# Altium project STM32_IO_SMD.PrjPcb
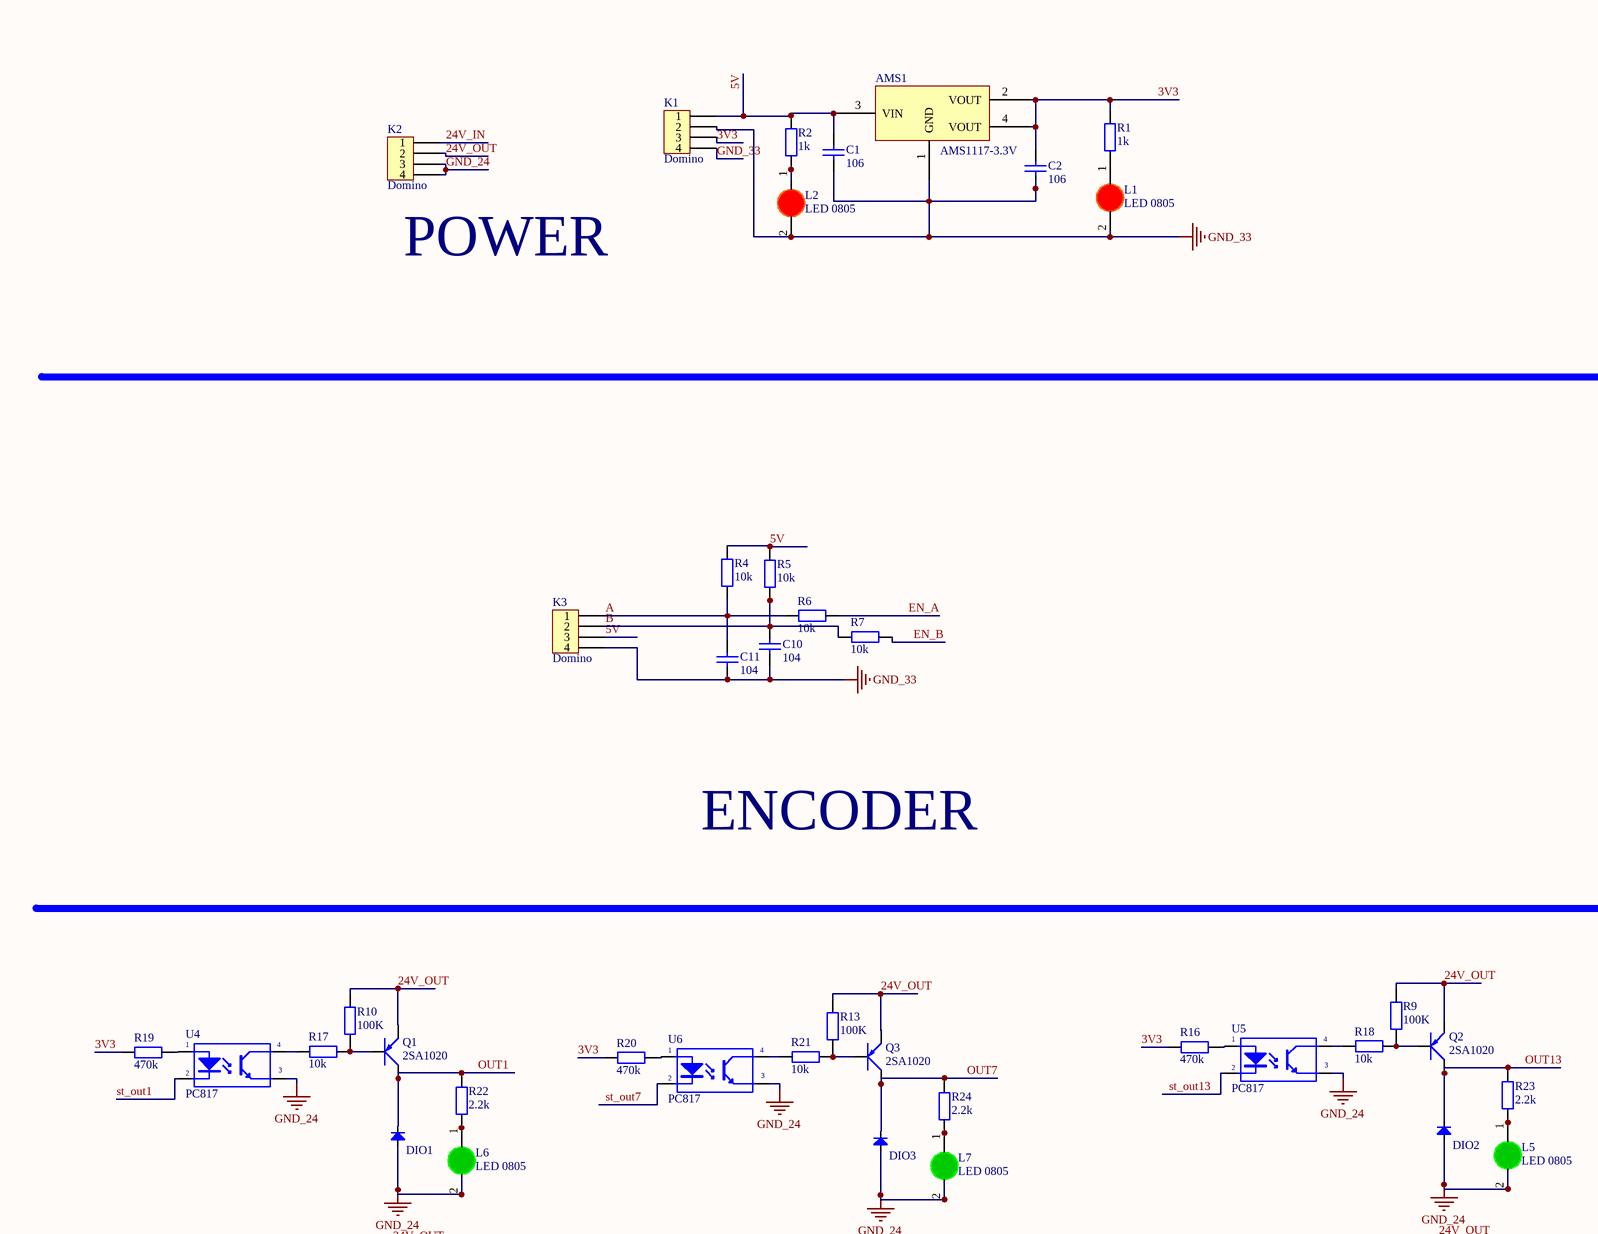
[diagram p0: schematic.SchDoc, top left]
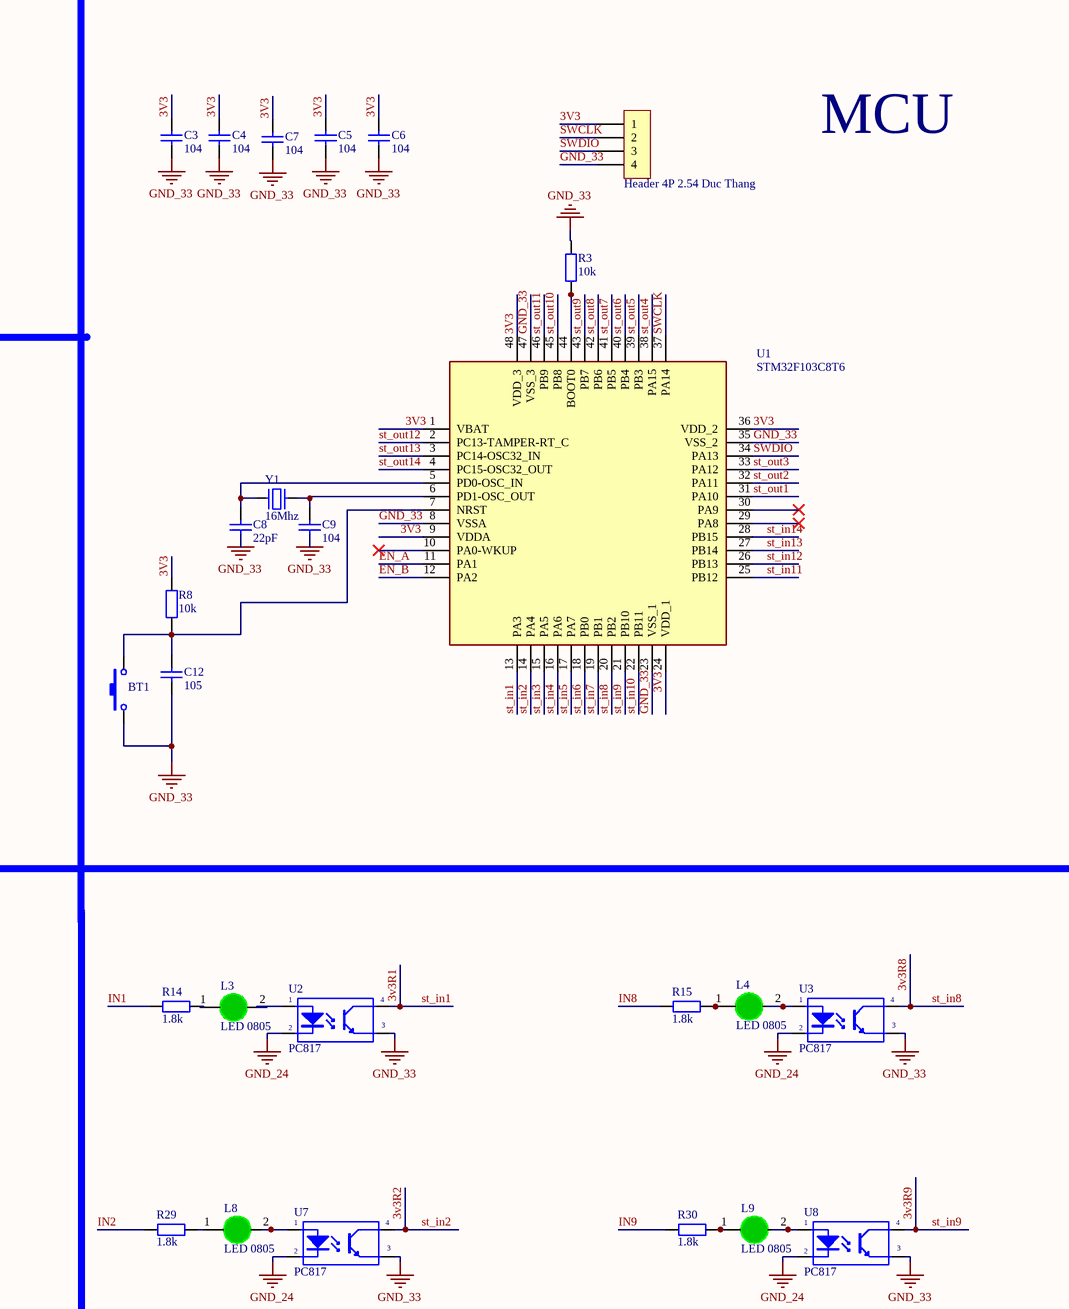
[diagram p1: schematic.SchDoc, top right]
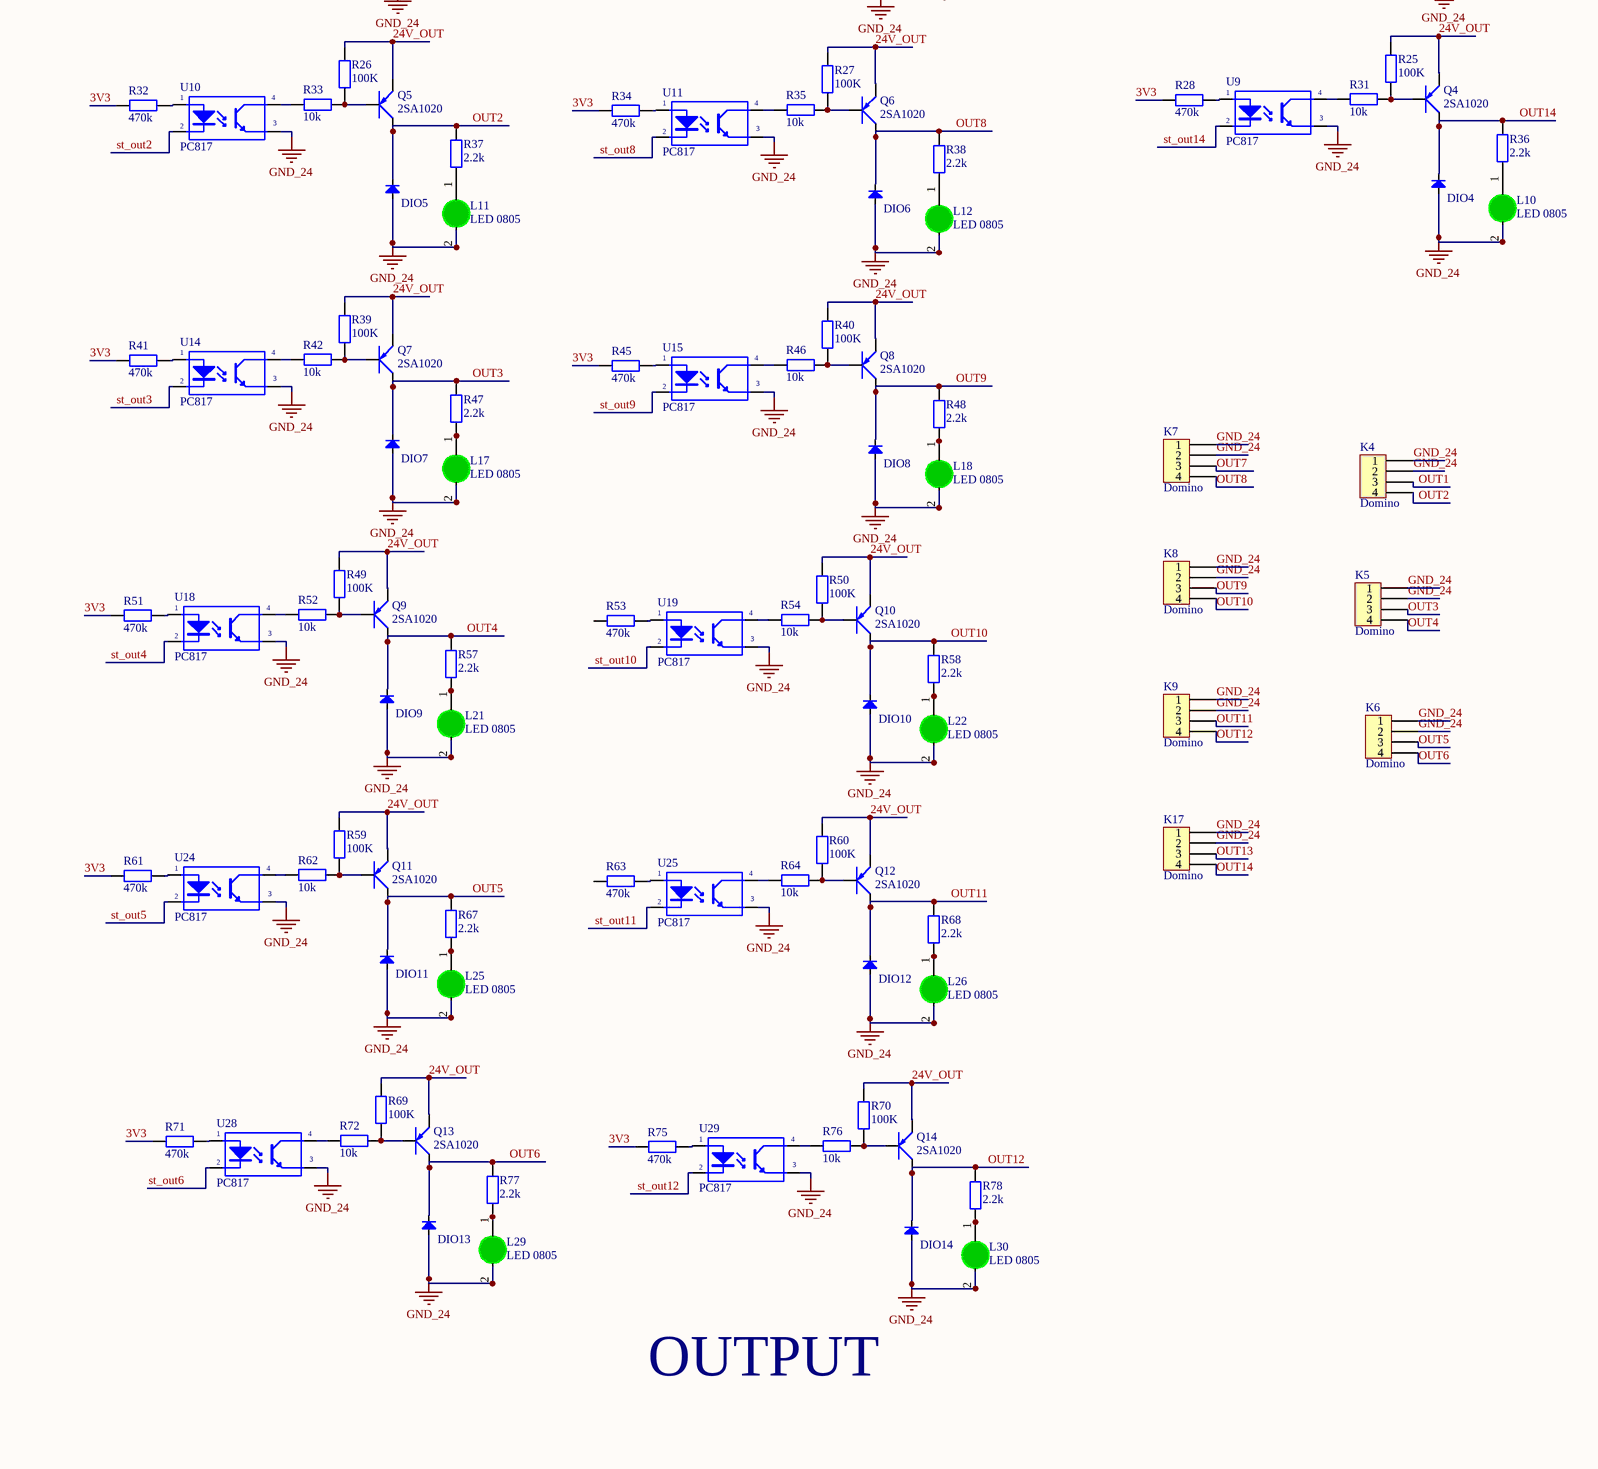
[diagram p2: schematic.SchDoc, bottom left]
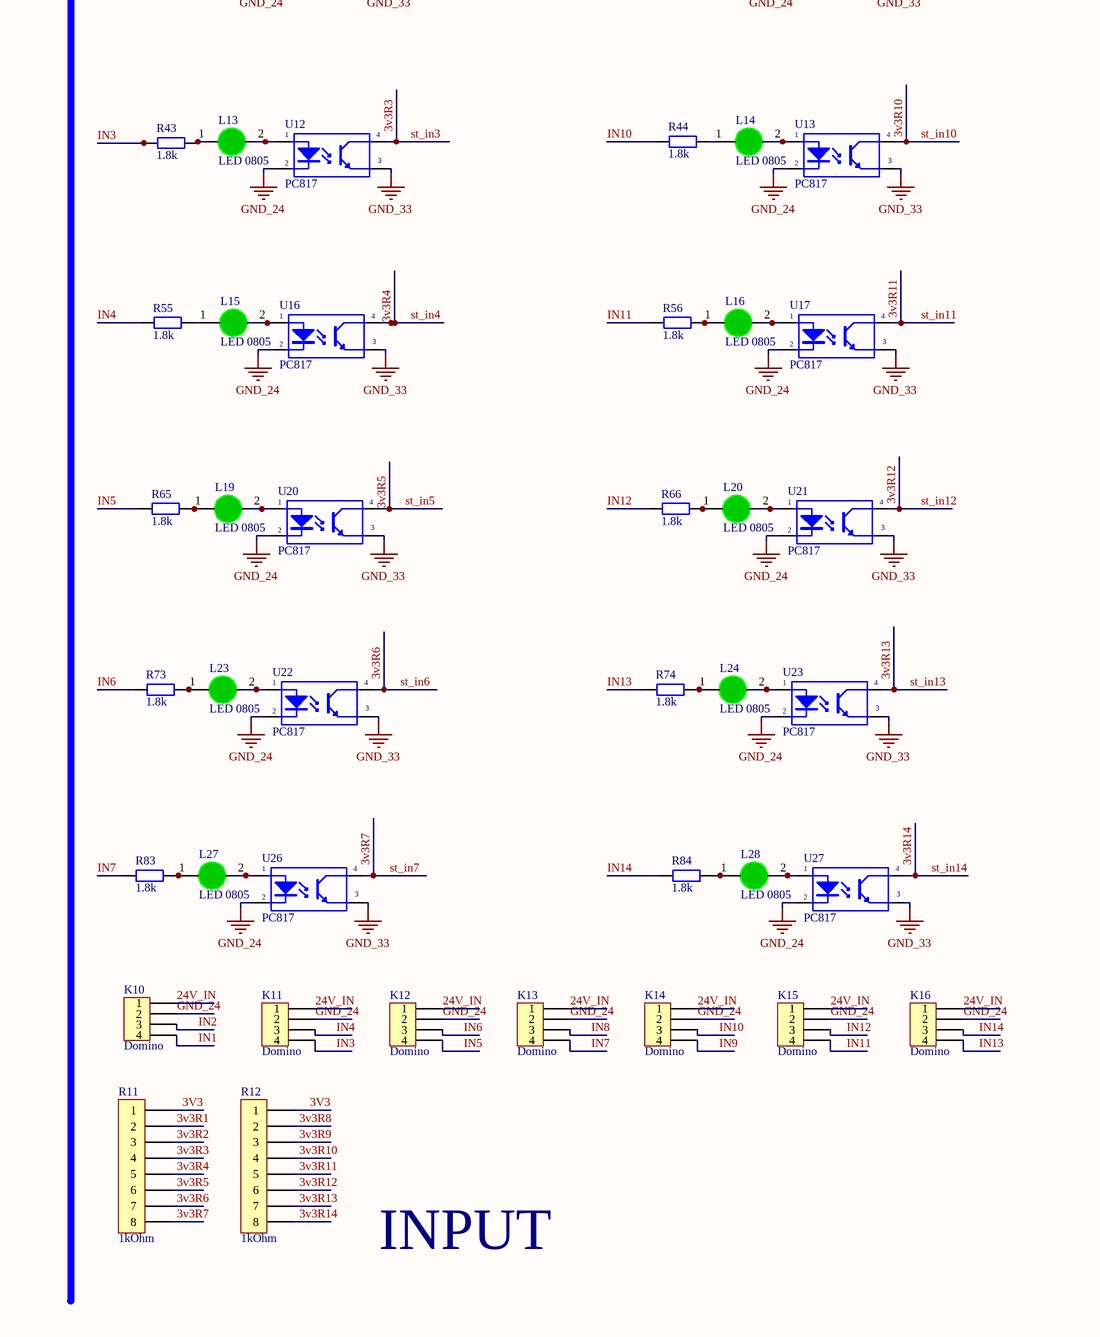
[diagram p3: schematic.SchDoc, bottom right]
1 sheet, 200 parts. Net scope: global (net labels, ports and power ports of the same name join across sheets).
Board file: PCB.PcbDoc

## Sheet schematic.SchDoc
size 500 x 500 mm; SheetNumber: 1; SheetTotal: 1

### Parts
AMS1  AMS1117-3.3V  [SOT223]
BT1  Nut Nhan 2 Chan SMD 3x6x2.5  [Nut Nhan 2 Chan SMD 3x6x2.5]  (value not drawn)
C1  106  [tu 1206]
C2  106  [tu 1206]
C3  104  [tu 1206]
C4  104  [tu 1206]
C5  104  [tu 1206]
C6  104  [tu 1206]
C7  104  [tu 1206]
C8  22pF  [tu 1206]
C9  104  [tu 1206]
C10  104  [tu 1206]
C11  104  [tu 1206]
C12  105  [tu 1206]
DIO1  Diode SMD  [DIO-SMD-123]  (value not drawn)
DIO2  Diode SMD  [DIO-SMD-123]  (value not drawn)
DIO3  Diode SMD  [DIO-SMD-123]  (value not drawn)
DIO4  Diode SMD  [DIO-SMD-123]  (value not drawn)
DIO5  Diode SMD  [DIO-SMD-123]  (value not drawn)
DIO6  Diode SMD  [DIO-SMD-123]  (value not drawn)
DIO7  Diode SMD  [DIO-SMD-123]  (value not drawn)
DIO8  Diode SMD  [DIO-SMD-123]  (value not drawn)
DIO9  Diode SMD  [DIO-SMD-123]  (value not drawn)
DIO10  Diode SMD  [DIO-SMD-123]  (value not drawn)
DIO11  Diode SMD  [DIO-SMD-123]  (value not drawn)
DIO12  Diode SMD  [DIO-SMD-123]  (value not drawn)
DIO13  Diode SMD  [DIO-SMD-123]  (value not drawn)
DIO14  Diode SMD  [DIO-SMD-123]  (value not drawn)
H1  Header 4P 2.54 Duc Thang  [XH2.54M-4]
K1  Domino  [KF128HL_2P]
K2  Domino  [KF128HL_2P]
K3  Domino  [KF128HL_2P]
K4  Domino  [KF128HL_2P]
K5  Domino  [KF128HL_2P]
K6  Domino  [KF128HL_2P]
K7  Domino  [KF128HL_2P]
K8  Domino  [KF128HL_2P]
K9  Domino  [KF128HL_2P]
K10  Domino  [KF128HL_2P]
K11  Domino  [KF128HL_2P]
K12  Domino  [KF128HL_2P]
K13  Domino  [KF128HL_2P]
K14  Domino  [KF128HL_2P]
K15  Domino  [KF128HL_2P]
K16  Domino  [KF128HL_2P]
K17  Domino  [KF128HL_2P]
L1  LED 0805  [LED-1206-Red]
L2  LED 0805  [LED-1206-Red]
L3  LED 0805  [LED-1206-Green]
L4  LED 0805  [LED-1206-Green]
L5  LED 0805  [LED-1206-Green]
L6  LED 0805  [LED-1206-Green]
L7  LED 0805  [LED-1206-Green]
L8  LED 0805  [LED-1206-Green]
L9  LED 0805  [LED-1206-Green]
L10  LED 0805  [LED-1206-Green]
L11  LED 0805  [LED-1206-Green]
L12  LED 0805  [LED-1206-Green]
L13  LED 0805  [LED-1206-Green]
L14  LED 0805  [LED-1206-Green]
L15  LED 0805  [LED-1206-Green]
L16  LED 0805  [LED-1206-Green]
L17  LED 0805  [LED-1206-Green]
L18  LED 0805  [LED-1206-Green]
L19  LED 0805  [LED-1206-Green]
L20  LED 0805  [LED-1206-Green]
L21  LED 0805  [LED-1206-Green]
L22  LED 0805  [LED-1206-Green]
L23  LED 0805  [LED-1206-Green]
L24  LED 0805  [LED-1206-Green]
L25  LED 0805  [LED-1206-Green]
L26  LED 0805  [LED-1206-Green]
L27  LED 0805  [LED-1206-Green]
L28  LED 0805  [LED-1206-Green]
L29  LED 0805  [LED-1206-Green]
L30  LED 0805  [LED-1206-Green]
Q1  2SA1020  [TO92-123]
Q2  2SA1020  [TO92-123]
Q3  2SA1020  [TO92-123]
Q4  2SA1020  [TO92-123]
Q5  2SA1020  [TO92-123]
Q6  2SA1020  [TO92-123]
Q7  2SA1020  [TO92-123]
Q8  2SA1020  [TO92-123]
Q9  2SA1020  [TO92-123]
Q10  2SA1020  [TO92-123]
Q11  2SA1020  [TO92-123]
Q12  2SA1020  [TO92-123]
Q13  2SA1020  [TO92-123]
Q14  2SA1020  [TO92-123]
R1  1k  [tro smd 1206]
R2  1k  [tro smd 1206]
R3  10k  [tro smd 1206]
R4  10k  [tro smd 1206]
R5  10k  [tro smd 1206]
R6  10k  [tro smd 1206]
R7  10k  [tro smd 1206]
R8  10k  [tro smd 1206]
R9  100K  [tro smd 1206]
R10  100K  [tro smd 1206]
R11  1kOhm  [resistor_bar]
R12  1kOhm  [resistor_bar]
R13  100K  [tro smd 1206]
R14  1.8k  [tro smd 1206]
R15  1.8k  [tro smd 1206]
R16  470k  [tro smd 1206]
R17  10k  [tro smd 1206]
R18  10k  [tro smd 1206]
R19  470k  [tro smd 1206]
R20  470k  [tro smd 1206]
R21  10k  [tro smd 1206]
R22  2.2k  [tro smd 1206]
R23  2.2k  [tro smd 1206]
R24  2.2k  [tro smd 1206]
R25  100K  [tro smd 1206]
R26  100K  [tro smd 1206]
R27  100K  [tro smd 1206]
R28  470k  [tro smd 1206]
R29  1.8k  [tro smd 1206]
R30  1.8k  [tro smd 1206]
R31  10k  [tro smd 1206]
R32  470k  [tro smd 1206]
R33  10k  [tro smd 1206]
R34  470k  [tro smd 1206]
R35  10k  [tro smd 1206]
R36  2.2k  [tro smd 1206]
R37  2.2k  [tro smd 1206]
R38  2.2k  [tro smd 1206]
R39  100K  [tro smd 1206]
R40  100K  [tro smd 1206]
R41  470k  [tro smd 1206]
R42  10k  [tro smd 1206]
R43  1.8k  [tro smd 1206]
R44  1.8k  [tro smd 1206]
R45  470k  [tro smd 1206]
R46  10k  [tro smd 1206]
R47  2.2k  [tro smd 1206]
R48  2.2k  [tro smd 1206]
R49  100K  [tro smd 1206]
R50  100K  [tro smd 1206]
R51  470k  [tro smd 1206]
R52  10k  [tro smd 1206]
R53  470k  [tro smd 1206]
R54  10k  [tro smd 1206]
R55  1.8k  [tro smd 1206]
R56  1.8k  [tro smd 1206]
R57  2.2k  [tro smd 1206]
R58  2.2k  [tro smd 1206]
R59  100K  [tro smd 1206]
R60  100K  [tro smd 1206]
R61  470k  [tro smd 1206]
R62  10k  [tro smd 1206]
R63  470k  [tro smd 1206]
R64  10k  [tro smd 1206]
R65  1.8k  [tro smd 1206]
R66  1.8k  [tro smd 1206]
R67  2.2k  [tro smd 1206]
R68  2.2k  [tro smd 1206]
R69  100K  [tro smd 1206]
R70  100K  [tro smd 1206]
R71  470k  [tro smd 1206]
R72  10k  [tro smd 1206]
R73  1.8k  [tro smd 1206]
R74  1.8k  [tro smd 1206]
R75  470k  [tro smd 1206]
R76  10k  [tro smd 1206]
R77  2.2k  [tro smd 1206]
R78  2.2k  [tro smd 1206]
R83  1.8k  [tro smd 1206]
R84  1.8k  [tro smd 1206]
U1  STM32F103C8T6  [LQFP-48_19.6_393_58X11_SMD]
U2  PC817  [DIP4]
U3  PC817  [DIP4]
U4  PC817  [DIP4]
U5  PC817  [DIP4]
U6  PC817  [DIP4]
U7  PC817  [DIP4]
U8  PC817  [DIP4]
U9  PC817  [DIP4]
U10  PC817  [DIP4]
U11  PC817  [DIP4]
U12  PC817  [DIP4]
U13  PC817  [DIP4]
U14  PC817  [DIP4]
U15  PC817  [DIP4]
U16  PC817  [DIP4]
U17  PC817  [DIP4]
U18  PC817  [DIP4]
U19  PC817  [DIP4]
U20  PC817  [DIP4]
U21  PC817  [DIP4]
U22  PC817  [DIP4]
U23  PC817  [DIP4]
U24  PC817  [DIP4]
U25  PC817  [DIP4]
U26  PC817  [DIP4]
U27  PC817  [DIP4]
U28  PC817  [DIP4]
U29  PC817  [DIP4]
Y1  16Mhz  [Thach Anh 2 chan cam]

### Nets
GND_24: DIO1.1(A) DIO2.1(A) DIO3.1(A) DIO4.1(A) DIO5.1(A) DIO6.1(A) DIO7.1(A) DIO8.1(A) DIO9.1(A) DIO10.1(A) DIO11.1(A) DIO12.1(A) DIO13.1(A) DIO14.1(A) K2.3 K2.4 K4.1 K4.2 K5.1 K5.2 K6.1 K6.2 K7.1 K7.2 K8.1 K8.2 K9.1 K9.2 K10.2 K11.2 K12.2 K13.2 K14.2 K15.2 K16.2 K17.1 K17.2 L5.2(K) L6.2(K) L7.2(K) L10.2(K) L11.2(K) L12.2(K) L17.2(K) L18.2(K) L21.2(K) L22.2(K) L25.2(K) L26.2(K) L29.2(K) L30.2(K) U2.2(K) U3.2(K) U4.3(E) U5.3(E) U6.3(E) U7.2(K) U8.2(K) U9.3(E) U10.3(E) U11.3(E) U12.2(K) U13.2(K) U14.3(E) U15.3(E) U16.2(K) U17.2(K) U18.3(E) U19.3(E) U20.2(K) U21.2(K) U22.2(K) U23.2(K) U24.3(E) U25.3(E) U26.2(K) U27.2(K) U28.3(E) U29.3(E)
GND_33: AMS1.1(GND) BT1.1 C1.2 C2.2 C3.2 C4.2 C5.2 C6.2 C7.2 C8.2 C9.2 C10.2 C11.2 C12.2 H1.4 K1.2 K1.4 K3.4 L1.2(K) L2.2(K) R3.2 U1.8(VSSA) U1.23(VSS_1) U1.35(VSS_2) U1.47(VSS_3) U2.3(E) U3.3(E) U7.3(E) U8.3(E) U12.3(E) U13.3(E) U16.3(E) U17.3(E) U20.3(E) U21.3(E) U22.3(E) U23.3(E) U26.3(E) U27.3(E)
3V3: AMS1.2(VOUT) AMS1.4(VOUT) C2.1 C3.1 C4.1 C5.1 C6.1 C7.1 H1.1 K1.3 R1.2 R8.2 R11.1 R12.1 R16.1 R19.1 R20.1 R28.1 R32.1 R34.1 R41.1 R45.1 R51.1 R61.1 R71.1 R75.1 U1.1(VBAT) U1.9(VDDA) U1.24(VDD_1) U1.36(VDD_2) U1.48(VDD_3)
3v3R1: R11.2 U1.13(PA3) U2.4(C)  [also labelled st_in1]
3v3R2: R11.3 U1.14(PA4) U7.4(C)  [also labelled st_in2]
3v3R3: R11.4 U1.15(PA5) U12.4(C)  [also labelled st_in3]
3v3R4: R11.5 U1.16(PA6) U16.4(C)  [also labelled st_in4]
3v3R5: R11.6 U1.17(PA7) U20.4(C)  [also labelled st_in5]
3v3R6: R11.7 U1.18(PB0) U22.4(C)  [also labelled st_in6]
3v3R7: R11.8 U1.19(PB1) U26.4(C)  [also labelled st_in7]
3v3R8: R12.2 U1.20(PB2) U3.4(C)  [also labelled st_in8]
3v3R9: R12.3 U1.21(PB10) U8.4(C)  [also labelled st_in9]
3v3R10: R12.4 U1.22(PB11) U13.4(C)  [also labelled st_in10]
3v3R11: R12.5 U1.25(PB12) U17.4(C)  [also labelled st_in11]
3v3R12: R12.6 U1.26(PB13) U21.4(C)  [also labelled st_in12]
3v3R13: R12.7 U1.27(PB14) U23.4(C)  [also labelled st_in13]
3v3R14: R12.8 U1.28(PB15) U27.4(C)  [also labelled st_in14]
5V: AMS1.3(VIN) C1.1 K1.1 K3.3 R2.2 R4.2 R5.2
24V_IN: K2.1 K10.1 K11.1 K12.1 K13.1 K14.1 K15.1 K16.1
24V_OUT: K2.2 Q1.1(E) Q2.1(E) Q3.1(E) Q4.1(E) Q5.1(E) Q6.1(E) Q7.1(E) Q8.1(E) Q9.1(E) Q10.1(E) Q11.1(E) Q12.1(E) Q13.1(E) Q14.1(E) R9.2 R10.2 R13.2 R25.2 R26.2 R27.2 R39.2 R40.2 R49.2 R50.2 R59.2 R60.2 R69.2 R70.2
A: C11.1 K3.1 R4.1 R6.2
B: C10.1 K3.2 R5.1 R7.2
EN_A: R6.1 U1.11(PA1)
EN_B: R7.1 U1.12(PA2)
IN1: K10.4 R14.1
IN2: K10.3 R29.1
IN3: K11.4 R43.1
IN4: K11.3 R55.1
IN5: K12.4 R65.1
IN6: K12.3 R73.1
IN7: K13.4 R83.1
IN8: K13.3 R15.1
IN9: K14.4 R30.1
IN10: K14.3 R44.1
IN11: K15.4 R56.1
IN12: K15.3 R66.1
IN13: K16.4 R74.1
IN14: K16.3 R84.1
OUT1: DIO1.2(K) K4.3 Q1.2(C) R22.2
OUT2: DIO5.2(K) K4.4 Q5.2(C) R37.2
OUT3: DIO7.2(K) K5.3 Q7.2(C) R47.2
OUT4: DIO9.2(K) K5.4 Q9.2(C) R57.2
OUT5: DIO11.2(K) K6.3 Q11.2(C) R67.2
OUT6: DIO13.2(K) K6.4 Q13.2(C) R77.2
OUT7: DIO3.2(K) K7.3 Q3.2(C) R24.2
OUT8: DIO6.2(K) K7.4 Q6.2(C) R38.2
OUT9: DIO8.2(K) K8.3 Q8.2(C) R48.2
OUT10: DIO10.2(K) K8.4 Q10.2(C) R58.2
OUT11: DIO12.2(K) K9.3 Q12.2(C) R68.2
OUT12: DIO14.2(K) K9.4 Q14.2(C) R78.2
OUT13: DIO2.2(K) K17.3 Q2.2(C) R23.2
OUT14: DIO4.2(K) K17.4 Q4.2(C) R36.2
st_out1: U1.31(PA10) U4.2(K)
st_out2: U1.32(PA11) U10.2(K)
st_out3: U1.33(PA12) U14.2(K)
st_out4: U1.38(PA15) U18.2(K)
st_out5: U1.39(PB3) U24.2(K)
st_out6: U1.40(PB4) U28.2(K)
st_out7: U1.41(PB5) U6.2(K)
st_out8: U1.42(PB6) U11.2(K)
st_out9: U1.43(PB7) U15.2(K)
st_out10: U1.45(PB8) U19.2(K)
st_out11: U1.46(PB9) U25.2(K)
st_out12: U1.2(PC13-TAMPER-RT_C) U29.2(K)
st_out13: U1.3(PC14-OSC32_IN) U5.2(K)
st_out14: U1.4(PC15-OSC32_OUT) U9.2(K)
SWCLK: H1.2 U1.37(PA14)
SWDIO: H1.3 U1.34(PA13)
NetBT1_2: BT1.2 C12.1 R8.1 U1.7(NRST)
NetC8_1: C8.1 U1.5(PD0-OSC_IN) Y1.1
NetC9_1: C9.1 U1.6(PD1-OSC_OUT) Y1.2
NetL1_1: L1.1(A) R1.1
NetL2_1: L2.1(A) R2.1
NetL3_1: L3.1(A) R14.2
NetL3_2: L3.2(K) U2.1(A)
NetL4_1: L4.1(A) R15.2
NetL4_2: L4.2(K) U3.1(A)
NetL5_1: L5.1(A) R23.1
NetL6_1: L6.1(A) R22.1
NetL7_1: L7.1(A) R24.1
NetL8_1: L8.1(A) R29.2
NetL8_2: L8.2(K) U7.1(A)
NetL9_1: L9.1(A) R30.2
NetL9_2: L9.2(K) U8.1(A)
NetL13_1: L13.1(A) R43.2
NetL13_2: L13.2(K) U12.1(A)
NetL14_1: L14.1(A) R44.2
NetL14_2: L14.2(K) U13.1(A)
NetL15_1: L15.1(A) R55.2
NetL15_2: L15.2(K) U16.1(A)
NetL16_1: L16.1(A) R56.2
NetL16_2: L16.2(K) U17.1(A)
NetL17_1: L17.1(A) R47.1
NetL18_1: L18.1(A) R48.1
NetL19_1: L19.1(A) R65.2
NetL19_2: L19.2(K) U20.1(A)
NetL20_1: L20.1(A) R66.2
NetL20_2: L20.2(K) U21.1(A)
NetL21_1: L21.1(A) R57.1
NetL22_1: L22.1(A) R58.1
NetL23_1: L23.1(A) R73.2
NetL23_2: L23.2(K) U22.1(A)
NetL24_1: L24.1(A) R74.2
NetL24_2: L24.2(K) U23.1(A)
NetL25_1: L25.1(A) R67.1
NetL26_1: L26.1(A) R68.1
NetL27_1: L27.1(A) R83.2
NetL27_2: L27.2(K) U26.1(A)
NetL28_1: L28.1(A) R84.2
NetL28_2: L28.2(K) U27.1(A)
NetL29_1: L29.1(A) R77.1
NetL30_1: L30.1(A) R78.1
NetQ1_3: Q1.3(B) R10.1 R17.1
NetQ2_3: Q2.3(B) R9.1 R18.1
NetQ3_3: Q3.3(B) R13.1 R21.1
NetQ4_3: Q4.3(B) R25.1 R31.1
NetQ5_3: Q5.3(B) R26.1 R33.1
NetQ6_3: Q6.3(B) R27.1 R35.1
NetQ7_3: Q7.3(B) R39.1 R42.1
NetQ8_3: Q8.3(B) R40.1 R46.1
NetQ9_3: Q9.3(B) R49.1 R52.1
NetQ10_3: Q10.3(B) R50.1 R54.1
NetQ11_3: Q11.3(B) R59.1 R62.1
NetQ12_3: Q12.3(B) R60.1 R64.1
NetQ13_3: Q13.3(B) R69.1 R72.1
NetQ14_3: Q14.3(B) R70.1 R76.1
NetR3_1: R3.1 U1.44(BOOT0)
NetR16_2: R16.2 U5.1(A)
NetR17_2: R17.2 U4.4(C)
NetR18_2: R18.2 U5.4(C)
NetR19_2: R19.2 U4.1(A)
NetR20_2: R20.2 U6.1(A)
NetR21_2: R21.2 U6.4(C)
NetR28_2: R28.2 U9.1(A)
NetR31_2: R31.2 U9.4(C)
NetR32_2: R32.2 U10.1(A)
NetR33_2: R33.2 U10.4(C)
NetR34_2: R34.2 U11.1(A)
NetR35_2: R35.2 U11.4(C)
NetR41_2: R41.2 U14.1(A)
NetR42_2: R42.2 U14.4(C)
NetR45_2: R45.2 U15.1(A)
NetR46_2: R46.2 U15.4(C)
NetR51_2: R51.2 U18.1(A)
NetR52_2: R52.2 U18.4(C)
NetR53_2: R53.2 U19.1(A)
NetR54_2: R54.2 U19.4(C)
NetR61_2: R61.2 U24.1(A)
NetR62_2: R62.2 U24.4(C)
NetR63_2: R63.2 U25.1(A)
NetR64_2: R64.2 U25.4(C)
NetR71_2: R71.2 U28.1(A)
NetR72_2: R72.2 U28.4(C)
NetR75_2: R75.2 U29.1(A)
NetR76_2: R76.2 U29.4(C)

Not connected (* = marked no-connect by the designer): L10 1(A); L11 1(A); L12 1(A); R36 1; R37 1; R38 1; R53 1; R63 1; U1 10(PA0-WKUP)* 29(PA8)* 30(PA9)*

### Notes on the sheet
- MCU
- (near K2) POWER
- ENCODER
- OUTPUT
- INPUT

### Library data of the parts
AMS1 = AMS1117 SMD: Dán; Value: AMS1117-3.3V SOT223; Don_Vi: Con; Ma_Hang: MH000596; Ghi_Chu: *; Kieu_Chan: *; Chung_Loai: Dán
BT1 = Nut Nhan 2 Chan SMD 3x6x2.5: Ma_Hang: MH001036; Ten: Nút Nhấn 2 Chân 3x6x2.5MM SMD
C1 C2 = Tu 1206 106 16V 20%: Dán; Don_Vi: Con; So_Chan: 2; Ten_Linh_Kien: Tụ 1206 106-10uF 20% 16V; Ma_Hang: MH004541; Chung_Loai: Dán; Kieu_Chan: *
C3-C7 C9-C11 = Tu 1206 104 50V 20%: Dán; Don_Vi: Con; So_Chan: 2; Ten_Linh_Kien: Tụ 1206 104-0.1uF 20% 50V; Ma_Hang: MH004544; Chung_Loai: Dán; Kieu_Chan: *
C8 = Tu 1206 22pF 50V 10%: Dán; Ma_Hang: MH004547; Don_Vi: Con; So_Chan: 2; Ten_Linh_Kien: Tụ 1206 22P 10% 50V; Chung_Loai: Dán; Kieu_Chan: *
C12 = Tu 1206 105 50V 20%: Dán; Don_Vi: Con; So_Chan: 2; Ten_Linh_Kien: Tụ 1206 105-1uF 20% 50V; Ma_Hang: MH004545; Chung_Loai: Dán; Kieu_Chan: *
DIO1-DIO14 = Diode SMD: Default Diode; Code - JEDEC: DO-214-AB; Value: 1N5007; Published: 8-Jun-2000; Revision: July-2002: Re-released for DXP Platform.; Publisher: Altium Limited
H1 = Header 4P 2.54 Duc Thang: Cắm; Ten_Linh_Kien: Header 4P XH2.54-4P Đực Thẳng; Don_Vi: Con; Ma_Hang: MH001285; Chung_Loai: Cắm
K1-K17 = KF128HL_2P
L1 L2 = LED 1206 Do: Dán; Don_Vi: Con; Ma_Hang: MH002334; Ten_Linh_Kien: LED1206 Màu Đỏ (Red); Ghi_Chu: *; Kieu_Chan: *; Chung_Loai: Dán
L3-L30 = LED 1206 Xanh La: Dán; Don_Vi: Con; Ma_Hang: MH002947; Ten_Linh_Kien: LED1206 Màu Xanh Lá (Green); Ghi_Chu: *; Kieu_Chan: *; Chung_Loai: Dán
Q1-Q14 = 2SA1015: PNP 600mW, ECB; Value: A1015
R1 R2 = Tro 1206 5% 1k: Dán; Don_Vi: Con; So_Chan: 2; Ten_Linh_Kien: Trở 1206 5% 1k; Ma_Hang: MH005904; Chung_Loai: Dán; Kieu_Chan: *
R3-R7 R17 R18 R21 R31 R33 R35 R42 R46 R52 R54 R62 R64 R72 R76 = Tro 1206 5% 10k: Dán; Don_Vi: Con; So_Chan: 2; Ten_Linh_Kien: Trở 1206 5% 10K; Ma_Hang: MH005909; Chung_Loai: Dán; Kieu_Chan: *
R8 = Tro 1206 1% 10k: Dán; Don_Vi: Con; So_Chan: 2; Ten_Linh_Kien: Trở 1206 1% 10k; Ma_Hang: MH005885; Chung_Loai: Dán; Kieu_Chan: *
R9 R10 R13 R25-R27 R39 R40 R49 R50 R59 R60 R69 R70 = Tro 1206 5% 100K: Dán; Don_Vi: Con; So_Chan: 2; Ten_Linh_Kien: Trở 1206 5% 100k; Ma_Hang: MH005921; Chung_Loai: Dán; Kieu_Chan: *
R11 R12 = resistor_bar: resistor bar 1kOhm
R14 R15 R29 R30 R43 R44 R55 R56 R65 R66 R73 R74 R83 R84 = Tro 1206 1% 2k: Dán; Don_Vi: Con; So_Chan: 2; Ma_Hang: MH005883; Ten_Linh_Kien: Trở 1206 1% 2k; Chung_Loai: Dán; Kieu_Chan: *
R16 R19 R20 R28 R32 R34 R41 R45 R51 R53 R61 R63 R71 R75 = Tro 1206 1% 470k: Dán; Don_Vi: Con; Ten_Linh_Kien: Trở 1206 5% 470k; So_Chan: 2; Ma_Hang: MH005899; Chung_Loai: Dán; Kieu_Chan: *
R22-R24 R36-R38 R47 R48 R57 R58 R67 R68 R77 R78 = Tro 1206 1% 2.2k: Dán; Chung_Loai: Cắm; Don_Vi: Con; So_Chan: 2; Ten_Linh_Kien: Trở 1206 1% 2.2k; Ma_Hang: MH005882; Kieu_Chan: *
U1 = IC_STM32F103C8T6: ARM® Cortex®-M3 STM32F1 Microcontroller IC 32-Bit 72MHz 64KB (64K x 8) FLASH 48-LQFP (7x7) /; Manufacturer: STMicroelectronics; Alternate Part Number-1: NA; Manufacturer Part Number: STM32F103C8T6; Case/Package: LQFP48; Supplier-1: LCSC; Supplier Part Number-1: STM32F103C8T6
U2-U29 = PC817: Single Opto; Value: PC817
Y1 = Thach Anh 2 chan Cam: Crystal For all Crystal 2pin.; Value: 4Mhz